# Altium schematic sheet IN_PIN.SchDoc
size A4; SheetNumber: 2
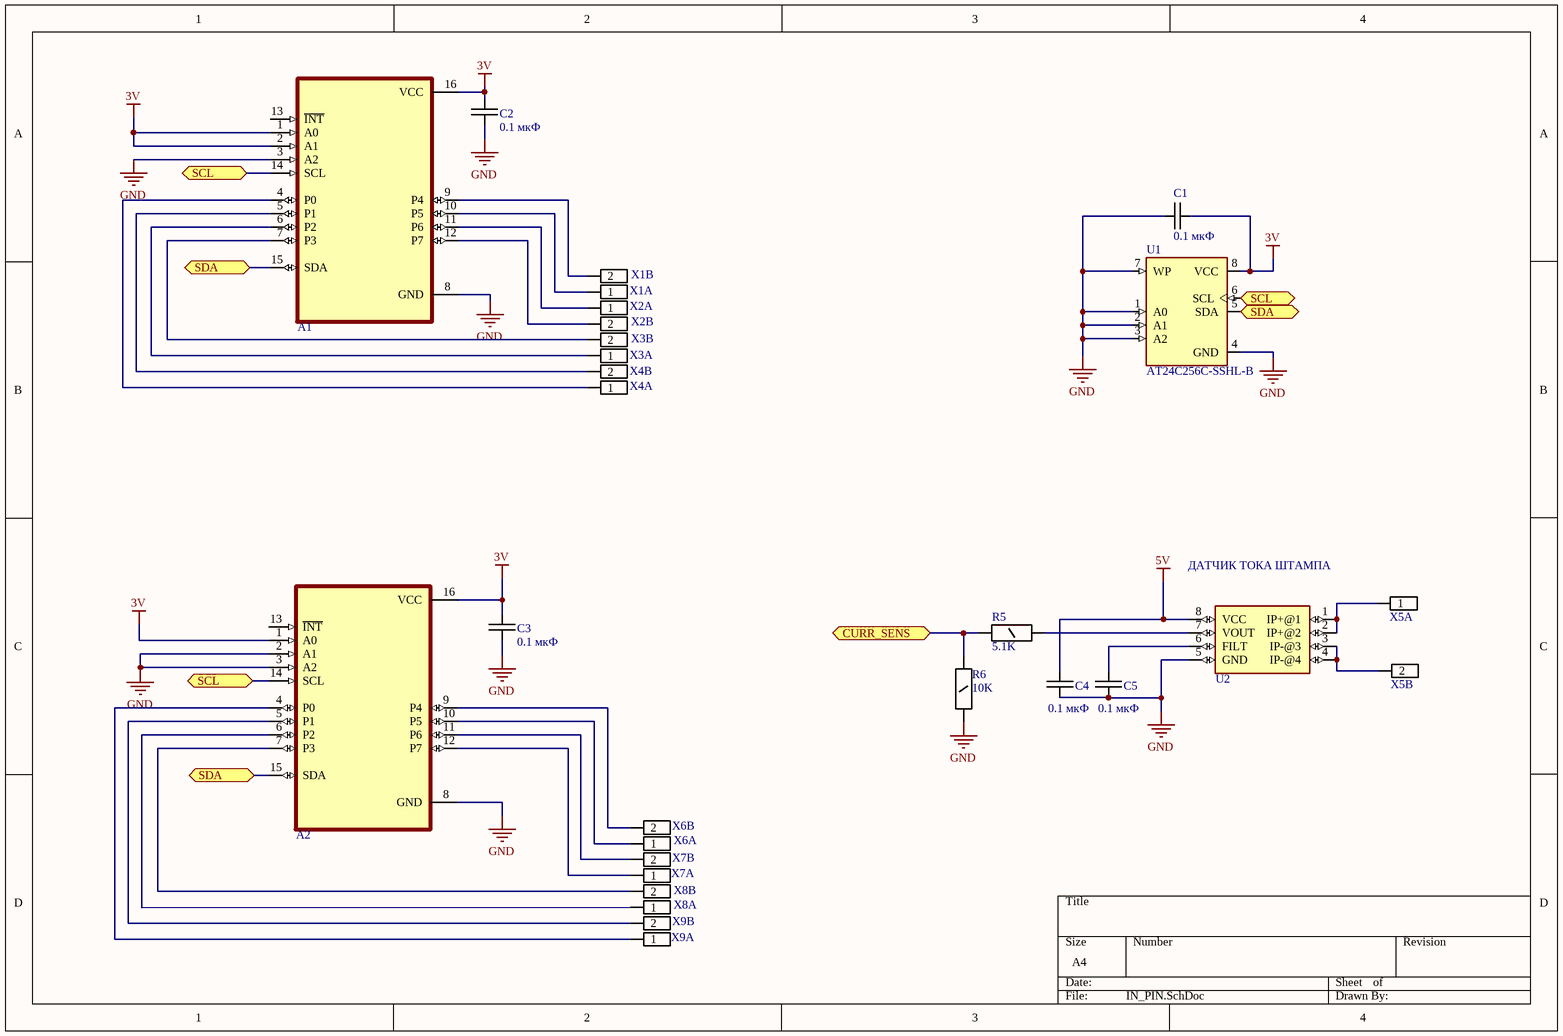
[diagram p0: IN_PIN.SchDoc]

## Parts
A1  PCF8574DW  [SOIC127P1030X265-16N]  (value not drawn)
A2  PCF8574DW  [SOIC127P1030X265-16N]  (value not drawn)
C1  0.1 мкФ  [C_0805]
C2  0.1 мкФ  [C_1206]
C3  0.1 мкФ  [C_1206]
C4  0.1 мкФ  [C_1206]
C5  0.1 мкФ  [C_1206]
R5  5.1K  [R_1206]
R6  10K  [R_1206]
U1  AT24C256C-SSHL-B  [SOIC8]
U2  ACS712  [SO08]  (value not drawn)
X1  DG508V-02  [DG508V-02]  (value not drawn)  (parts A,B of 2)
X2  DG508V-02  [DG508V-02]  (value not drawn)  (parts A,B of 2)
X3  DG508V-02  [DG508V-02]  (value not drawn)  (parts A,B of 2)
X4  DG508V-02  [DG508V-02]  (value not drawn)  (parts A,B of 2)
X5  DG508V-02  [DG508V-02]  (value not drawn)  (parts A,B of 2)
X6  DG508V-02  [DG508V-02]  (value not drawn)  (parts A,B of 2)
X7  DG508V-02  [DG508V-02]  (value not drawn)  (parts A,B of 2)
X8  DG508V-02  [DG508V-02]  (value not drawn)  (parts A,B of 2)
X9  DG508V-02  [DG508V-02]  (value not drawn)  (parts A,B of 2)

## Ports
CURR_SENS, SCL, SDA

## Nets
3V: A1.1(A0) A1.2(A1) A1.16(VCC) A2.1(A0) A2.16(VCC) C1.1 C2.1 C3.1 U1.8(VCC)
5V: C4.1 U2.8(VCC)
GND: A1.3(A2) A1.8(GND) A2.2(A1) A2.3(A2) A2.8(GND) C1.2 C2.2 C3.2 C4.2 C5.2 R6.2 U1.1(A0) U1.2(A1) U1.3(A2) U1.4(GND) U1.7(WP) U2.5(GND)
CURR_SENS: R5.2 R6.1 ; port CURR_SENS
SCL: A1.14(SCL) A2.14(SCL) U1.6(SCL) ; port SCL
SDA: A1.15(SDA) A2.15(SDA) U1.5(SDA) ; port SDA
NetA1_4: A1.4(P0) X4.1
NetA1_5: A1.5(P1) X4.2
NetA1_6: A1.6(P2) X3.1
NetA1_7: A1.7(P3) X3.2
NetA1_9: A1.9(P4) X1.2
NetA1_10: A1.10(P5) X1.1
NetA1_11: A1.11(P6) X2.1
NetA1_12: A1.12(P7) X2.2
NetA2_4: A2.4(P0) X9.1
NetA2_5: A2.5(P1) X9.2
NetA2_6: A2.6(P2) X8.1
NetA2_7: A2.7(P3) X8.2
NetA2_9: A2.9(P4) X6.2
NetA2_10: A2.10(P5) X6.1
NetA2_11: A2.11(P6) X7.2
NetA2_12: A2.12(P7) X7.1
NetC5_1: C5.1 U2.6(FILT)
NetR5_1: R5.1 U2.7(VOUT)
NetU2_1: U2.1(IP+@1) U2.2(IP+@2) X5.1
NetU2_3: U2.3(IP-@3) U2.4(IP-@4) X5.2

Not connected (* = marked no-connect by the designer): A1 13(~{INT}); A2 13(~{INT})

## Notes on the sheet
- (near U2) ДАТЧИК ТОКА ШТАМПА

## Library data of the parts
A1 A2 = PCF8574DW: Remote 8-Bit I/O Expander for I2C-Bus 16-SOIC -40 to 85; MF: Texas Instruments; Package: SOIC-16 Texas Instruments; SnapEDA_Link: https://www.snapeda.com/parts/PCF8574DW/Texas%20Instruments/view-part/480923/?ref=snap; DigiKey-Purchase-URL: https://snapeda.com/shop?store=DigiKey&id=480923; MP: PCF8574DW; Value: *; Availability: Unavailable; Texas_Instruments-Purchase-URL: https://snapeda.com/shop?store=Texas+Instruments&id=480923; Price: None; Mouser-Purchase-URL: https://snapeda.com/shop?store=Mouser&id=480923
C1-C3 = Конденсатор 0805: SMD; Name: 0805; Voltage: 50B; Tolerance: 10%; Type: Конденсатор ЧИП; Value: 0.1 мкФ; Mounting: SMD
C4 C5 = Конденсатор 0603: SMD; Name: 0603; Voltage: 50B; Tolerance: 10%; Type: Конденсатор ЧИП; Value: 0.1 мкФ; Mounting: SMD
R5 = Резистор 1206: 0,25 Вт; Name: 1206; Type: Резистор ЧИП; Mounting: SMD
R6 = Резистор 1206: 0,25 Вт; Name: 1206; Power: 0.25 Вт; Tolerance: 5%; Voltage: 200В; Type: Резистор ЧИП; Value: 10K; Mounting: SMD
U1 = AT24C256C-SSHL-B: EEPROM Memory IC 256Kb _32K x 8_ IÂ²C 1MHz 550ns 8-SOIC; MF: Microchip; Value: *; SnapEDA_Link: https://www.snapeda.com/parts/AT24C256C-SSHL-B/Microchip/view-part/2112315/?ref=snap; Package: SO-8 Microchip; MP: AT24C256C-SSHL-B; Digi-Key_Purchase_URL: https://www.digikey.sg/product-detail/en/microchip-technology/AT24C256C-SSHL-B/AT24C256C-SSHL-B-ND/2271121?utm_source=snapeda&utm_medium=aggregator&utm_campaign=symbol; Digi-Key_Part_Number: AT24C256C-SSHL-B-ND
U2 = ACS712: Current Sensor 5A 1 Channel Hall Effect, Open Loop Bidirectional 8-SOIC (0.154, 3.90mm Width); MF: Allegro MicroSystems; Availability: In Stock; MP: ACS712; Price: None; Value: *; SnapEDA_Link: https://www.snapeda.com/parts/ACS712/Allegro+MicroSystems+LLC/view-part/?ref=snap; Check_prices: https://www.snapeda.com/parts/ACS712/Allegro+MicroSystems+LLC/view-part/?ref=eda; Package: None
X1-X9 = DG508V-02: клеммник винтовой 2к.,5.08мм; Analog: MKDS 2/3; Name: DG508V-02; Type: шаг 5,08 мм; Mounting: в отверстие